# EAGLE design SparkFun_tDof-TMF8821_HQ (EAGLE 9.6.2)
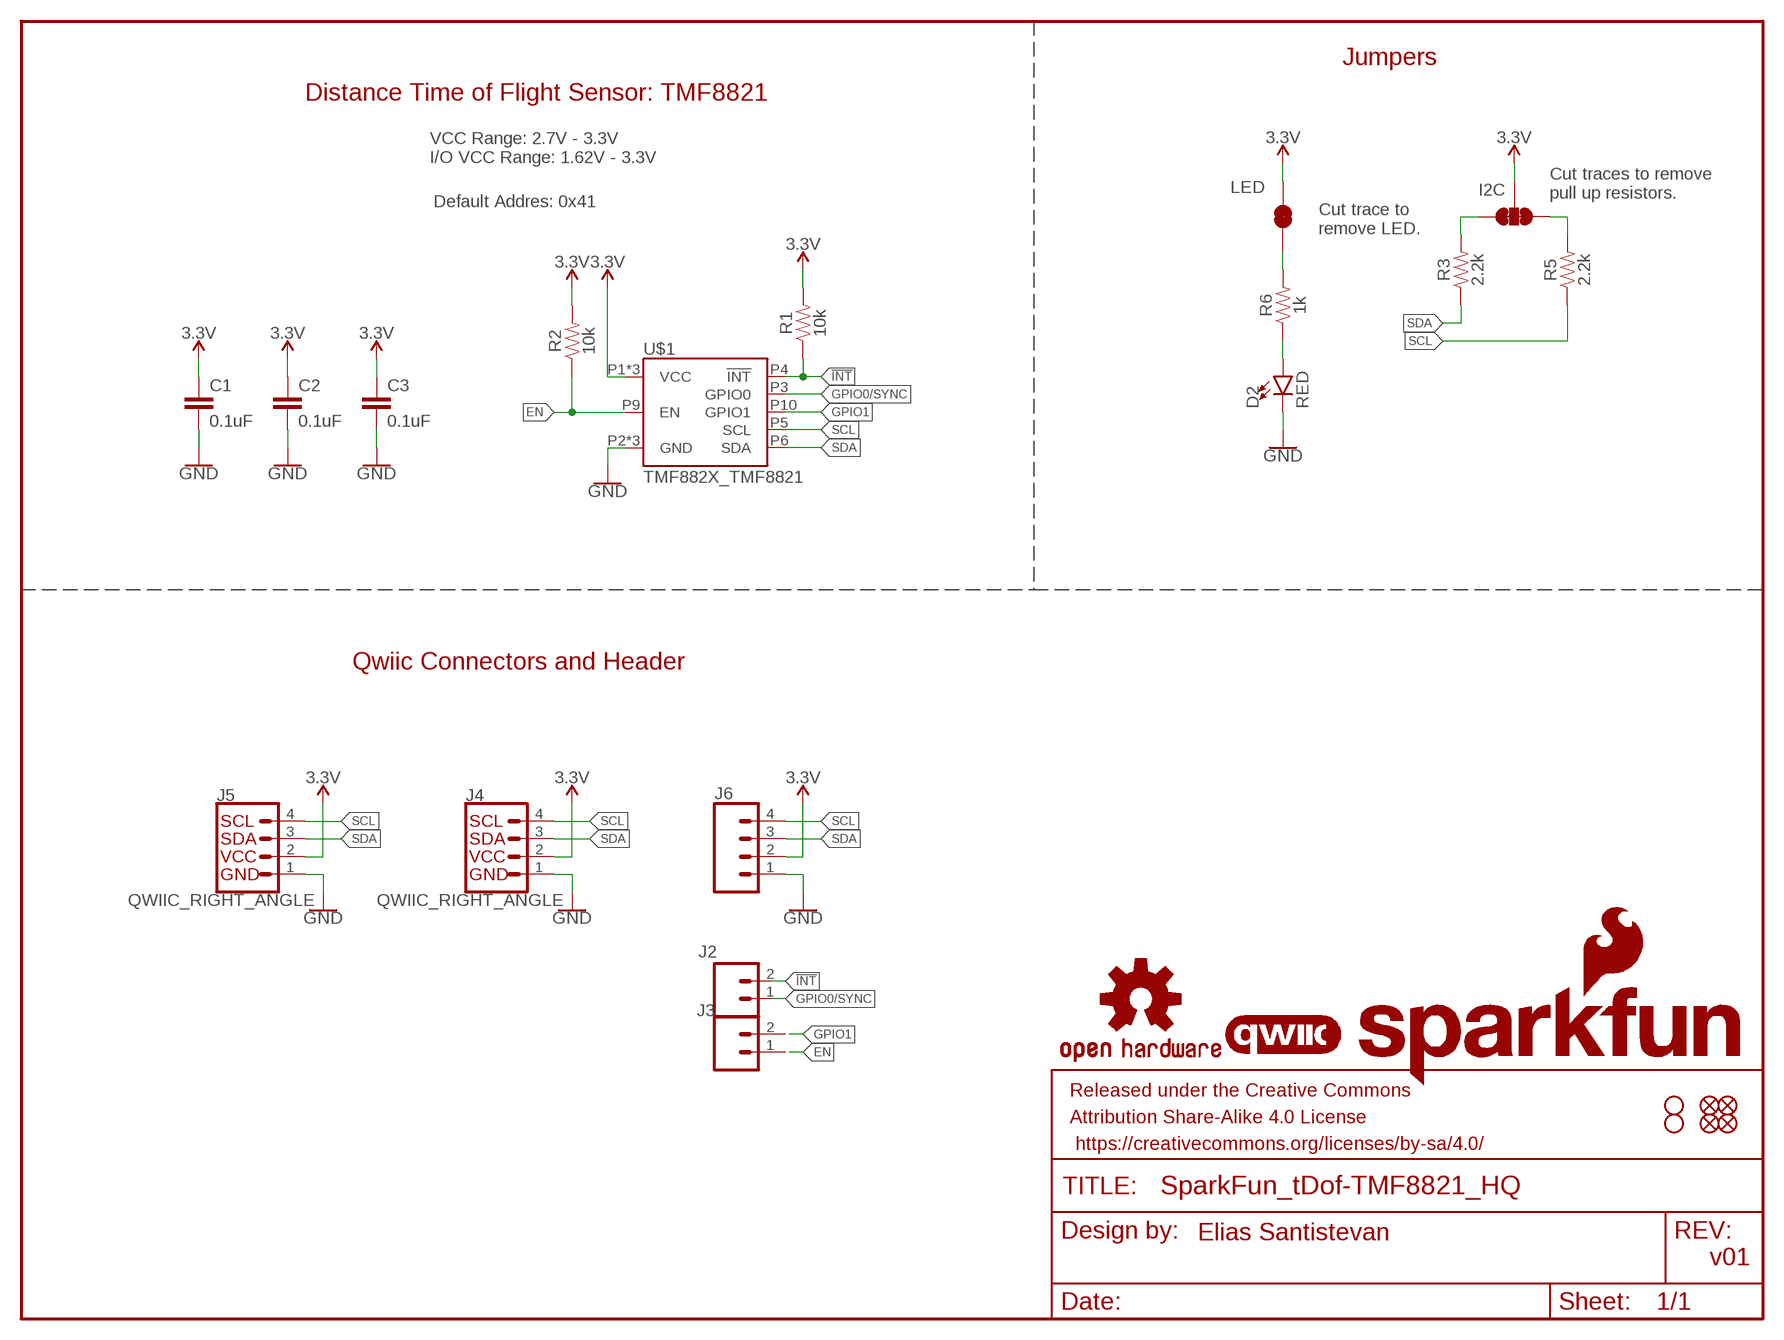
[diagram p0: schematic, sheet 1]

## Parts
C1  0.1uF  0.1UF-0402T-6.3V-10%-X7R  [0402-TIGHT]
C2  0.1uF  0.1UF-0402T-6.3V-10%-X7R  [0402-TIGHT]
C3  0.1uF  0.1UF-0402T-6.3V-10%-X7R  [0402-TIGHT]
D2  RED  LED-RED0603  [LED-0603]
FD5  FIDUCIALUFIDUCIAL  [FIDUCIAL-MICRO]
FD6  FIDUCIALUFIDUCIAL  [FIDUCIAL-MICRO]
FD7  FIDUCIALUFIDUCIAL  [FIDUCIAL-MICRO]
FD8  FIDUCIALUFIDUCIAL  [FIDUCIAL-MICRO]
FRAME2  FRAME-LETTER  [CREATIVE_COMMONS]
H7  STAND-OFFTIGHT  [STAND-OFF-TIGHT]
H8  STAND-OFFTIGHT  [STAND-OFF-TIGHT]
I2C  I2C_PU  JUMPER-SMT_3_2-NC_TRACE_SILK  [SMT-JUMPER_3_2-NC_TRACE_SILK]
J2  CONN_021X02_NO_SILK  [1X02_NO_SILK]
J3  CONN_021X02_NO_SILK  [1X02_NO_SILK]
J4  QWIIC_RIGHT_ANGLE  QWIIC_CONNECTORJS-1MM  [JST04_1MM_RA]
J5  QWIIC_RIGHT_ANGLE  QWIIC_CONNECTORJS-1MM  [JST04_1MM_RA]
J6  CONN_041X04_NO_SILK  [1X04_NO_SILK]
LED  LED  JUMPER-SMT_2_NC_TRACE_SILK  [SMT-JUMPER_2_NC_TRACE_SILK]
LOGO1  SFE_LOGO_NAME_FLAMEBLANK  [BLANK]
LOGO2  QWIIC_LOGO_3MM  [QWIIC_3MM]
LOGO3  OSHW-LOGONO_SILK  [DUMMY]
R1  10k  10KOHM-0402T-1/16W-1%  [0402-TIGHT]
R2  10k  10KOHM-0402T-1/16W-1%  [0402-TIGHT]
R3  2.2k  2.2KOHM-0402T-1/16W-1%  [0402-TIGHT]
R5  2.2k  2.2KOHM-0402T-1/16W-1%  [0402-TIGHT]
R6  1k  1KOHM-0402T-1/16W-1%  [0402-TIGHT]
U$1  TMF882X_TMF8821  [TMF882X]

## Nets
3.3V: C1.1 C2.1 C3.1 I2C.2 J4.2 J5.2 J6.2 LED.2 R1.2 R2.2 U$1.P1(VCC) U$1.P7(VCC) U$1.P12(VCC)
!INT!: J2.2 R1.1 U$1.P4(!INT!)
EN: J3.1 R2.1 U$1.P9(EN)
GND: C1.2 C2.2 C3.2 D2.C J4.1 J5.1 J6.1 U$1.P2(GND) U$1.P8(GND) U$1.P11(GND)
GPIO0/SYNC: J2.1 U$1.P3(GPIO0)
GPIO1: J3.2 U$1.P10(GPIO1)
N$5: D2.A R6.1
N$6: LED.1 R6.2
N$7: I2C.3 R3.2
N$8: I2C.1 R5.2
SCL: J4.4 J5.4 J6.4 R5.1 U$1.P5(SCL)
SDA: J4.3 J5.3 J6.3 R3.1 U$1.P6(SDA)

## Notes on the sheet
- Jumpers
- Distance Time of Flight Sensor: TMF8821
- VCC Range: 2.7V - 3.3V
  I/O VCC Range: 1.62V - 3.3V
- Cut traces to remove 
  pull up resistors.
- Default Addres: 0x41
- Cut trace to 
  remove LED.
- Qwiic Connectors and Header
- Elias Santistevan
- v01

## Library data of the parts
C1-C3 = SparkFun-Capacitors:0.1UF: 0.1µF ceramic capacitors A capacitor is a passive two-terminal electrical component used to store electrical energy temporarily in an electric field.; PROD_ID: CAP-14993
D2 = SparkFun-LED:LED-RED: Red SMD LED Used in manufacturing of most products at SparkFun Packages: 0603 - SMD 0603 package [Product Link] <http://docs.avagotech.com/docs/AV02-0551EN> 0603 SMART - SMD 0603 SMART package ( more efficient and expensive)[Product Link] <http://www.osram-os.com/Graphics/XPic2/00077099_0.pdf> 1206 - SMD1206 package [Product Link] <https://www.sparkfun.com/datasheets/DevTools/LilyPad/Q150OVS4.pdff> SparkFun Products: Pro Mini 328 -5V <https://www.sparkfun.com/products/821> RedBoard <https://www.sparkfun.com/products/12757> IOIO-OTG <https://www.sparkfun.com/products/13613>; PROD_ID: DIO-00819
FD5-FD8 = SparkFun-Aesthetics:FIDUCIAL: Fiducial Alignment Points Point-of-reference for pick-and-place machines and other optical instruments.
FRAME2 = SparkFun-Aesthetics:FRAME-LETTER: Schematic Frame - Letter Standard 8.5x11 US Letter frame
H7 H8 = SparkFun-Hardware:STAND-OFF: Stand Off Drill holes for mechanically mounting via screws, standoffs, etc. Note: Use the keepout ring to avoid running the screw head into surrounding components. Variant Overviews STAND-OFF - Mechanical footprint for a #4 phillips button head screw. STAND-OFF-TIGHT - Mechanical footprint for a #4 phillips button head screw, Example SparkFun Products Screw - Phillips Head (1/4", 4-40, 10 pack) <https://www.sparkfun.com/products/10453> (PRT-10453) Screw - Phillips Head (1/2", 4-40, 10 pack) <https://www.sparkfun.com/products/10452> (PRT-10452) Screw - Phillips Head (3/4", 4-40, 10 pack) <https://www.sparkfun.com/products/10451> (PRT-10451) Screw - Phillips Head (1", 4-40, 10 pack) <https://www.sparkfun.com/products/10450> (PRT-10450)
I2C = SparkFun-Jumpers:JUMPER-SMT_3_2-NC_TRACE: Normally closed trace jumper (2 of 2 connections) This jumper has a trace between all three pads so they are normally closed (NC). Use a razor knife to open the connection(s). For best results follow the IPC guidelines for cutting traces: Cutout at least 0.063 mm (0.005 in). Remove all loose material to clean up the cut area. Seal the cut with an approved epoxy. Reapply solder to reclose the connection(s).
J2 J3 = SparkFun-Connectors:CONN_02: Multi connection point. Often used as Generic Header-pin footprint for 0.1 inch spaced/style header connections On any of the 0.1 inch spaced packages, you can populate with these: Break Away Headers - Straight <https://www.sparkfun.com/products/116> (PRT-00116) Break Away Male Headers - Right Angle <https://www.sparkfun.com/products/553> (PRT-00553) Female Headers <https://www.sparkfun.com/products/115> (PRT-00115) Break Away Headers - Machine Pin <https://www.sparkfun.com/products/117> (PRT-00117) Break Away Female Headers - Swiss Machine Pin <https://www.sparkfun.com/products/743> (PRT-00743) For SCREWTERMINALS and SPRING TERMINALS visit here: Screw Terimnals on SparkFun.com <https://www.sparkfun.com/search/results?term=Screw+Terminals> (5mm/3.5mm/2.54mm spacing) This device is also useful as a general connection point to wire up your design to another part of your project. Our various solder wires solder well into these plated through hole pads. Hook-Up Wire - Assortment (Stranded, 22 AWG) <https://www.sparkfun.com/products/11375> (PRT-11375) Hook-Up Wire - Assortment (Solid Core, 22 AWG) <https://www.sparkfun.com/products/11367> (PRT-11367) View the entire wire category on our website here <https://www.sparkfun.com/categories/141> Special notes: Molex polarized connector foot print use with: PRT-08233 with associated crimp pins and housings. 2.54_SCREWTERM for use with PRT-10571. 3.5mm Screw Terminal footprints for PRT-08084 5mm Screw Terminal footprints for use with PRT-08432
J4 J5 = SparkFun-Connectors:QWIIC_CONNECTOR: SparkFun I2C Standard Qwiic Connector An SMD 1mm pitch JST connector makes it easy and quick (get it? Qwiic?) to connect I2C devices to each other. The Qwiic system <http://www.sparkfun.com/qwiic> enables fast and solderless connection between popular platforms and various sensors and actuators. We carry 200mm <https://www.sparkfun.com/products/14204>, 100mm <https://www.sparkfun.com/products/14205>, 50mm <https://www.sparkfun.com/products/14206>, and breadboard friendly <https://www.sparkfun.com/products/14207> Qwiic cables. We also offer 10 pcs strips <https://www.sparkfun.com/products/14323> the SMD connectors.; PROD_ID: CONN-13694
J6 = SparkFun-Connectors:CONN_04: Multi connection point. Often used as Generic Header-pin footprint for 0.1 inch spaced/style header connections On any of the 0.1 inch spaced packages, you can populate with these: Break Away Headers - Straight <https://www.sparkfun.com/products/116> (PRT-00116) Break Away Male Headers - Right Angle <https://www.sparkfun.com/products/553> (PRT-00553) Female Headers <https://www.sparkfun.com/products/115> (PRT-00115) Break Away Headers - Machine Pin <https://www.sparkfun.com/products/117> (PRT-00117) Break Away Female Headers - Swiss Machine Pin <https://www.sparkfun.com/products/743> (PRT-00743) For SCREWTERMINALS and SPRING TERMINALS visit here: Screw Terimnals on SparkFun.com <https://www.sparkfun.com/search/results?term=Screw+Terminals> (5mm/3.5mm/2.54mm spacing) This device is also useful as a general connection point to wire up your design to another part of your project. Our various solder wires solder well into these plated through hole pads. Hook-Up Wire - Assortment (Stranded, 22 AWG) <https://www.sparkfun.com/products/11375> (PRT-11375) Hook-Up Wire - Assortment (Solid Core, 22 AWG) <https://www.sparkfun.com/products/11367> (PRT-11367) View the entire wire category on our website here <https://www.sparkfun.com/categories/141> Special notes: Molex polarized connector foot print use with SKU : PRT-08231 with associated crimp pins and housings. 1MM SMD Version SKU: PRT-10208; PROD_ID: CONN-09696
LED = SparkFun-Jumpers:JUMPER-SMT_2_NC_TRACE: Normally closed trace jumper This jumper has a trace between two pads so it's normally closed (NC). Use a razor knife to open the connection. For best results follow the IPC guidelines for cutting traces: Cutout at least 0.063 mm (0.005 in). Remove all loose material to clean up the cut area. Seal the cut with an approved epoxy. Reapply solder to reclose the connection.
LOGO1 = SparkFun-Aesthetics:SFE_LOGO_NAME_FLAME: SparkFun Font Logo w/ Flame This is the SparkFun full logo. The logo on the schematic will always be the same size; the package variant is the height of the flame part of the logo. Default layer for the logo on the board is tSilk.
LOGO2 = SparkFun-Aesthetics:QWIIC_LOGO: Qwiic Logos for placement on schematic and PCB. The 5.5mm silk logo is best for placing next to Qwiic connector.
LOGO3 = SparkFun-Aesthetics:OSHW-LOGO: Open-Source Hardware (OSHW) Logo This logo indicates the piece of hardware it is found on incorporates a OSHW license and/or adheres to the definition of open source hardware found here: http://freedomdefined.org/OSHW
R1 R2 = SparkFun-Resistors:10KOHM: 10kΩ resistor A resistor is a passive two-terminal electrical component that implements electrical resistance as a circuit element. Resistors act to reduce current flow, and, at the same time, act to lower voltage levels within circuits. - Wikipedia; PROD_ID: RES-14241
R3 R5 = SparkFun-Resistors:2.2KOHM: 2.2kΩ resistor A resistor is a passive two-terminal electrical component that implements electrical resistance as a circuit element. Resistors act to reduce current flow, and, at the same time, act to lower voltage levels within circuits. - Wikipedia; PROD_ID: RES-14341
R6 = SparkFun-Resistors:1KOHM: 1kΩ resistor A resistor is a passive two-terminal electrical component that implements electrical resistance as a circuit element. Resistors act to reduce current flow, and, at the same time, act to lower voltage levels within circuits. - Wikipedia; PROD_ID: RES-14342
U$1 = TMF882X:TMF882X; PROD_ID: IC-16433

## Board
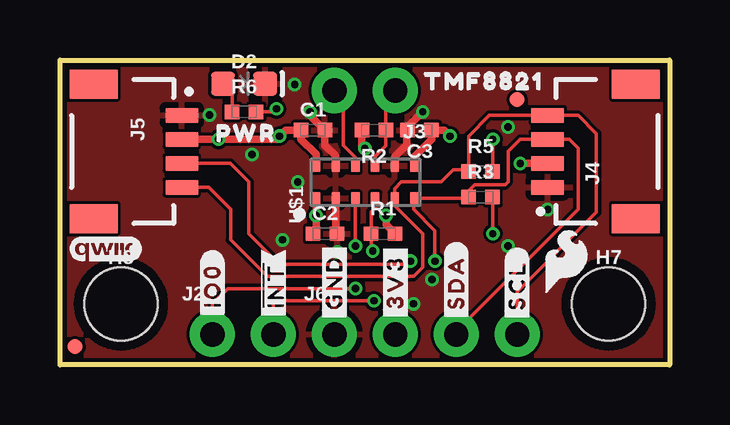
[diagram p1: board, top side]
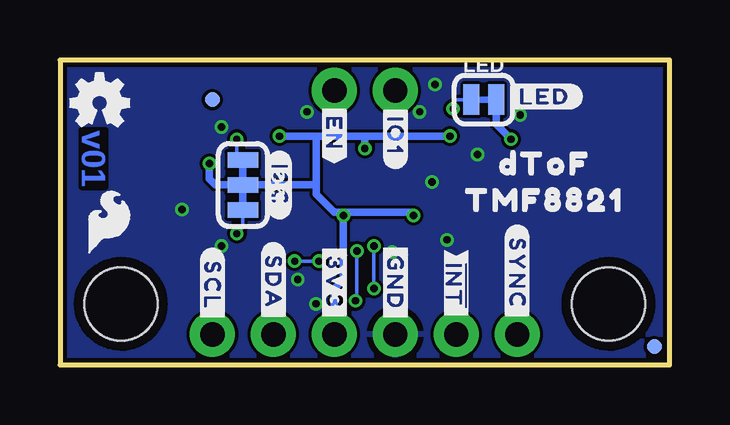
[diagram p2: board, bottom side, seen from below]

Size 25.4 x 12.7 mm. Coordinates in mm from the lower left corner, seen from the top.
Outline: 0,0 0,12.7 25.4,12.7 25.4,0 0,0
Copper layers (1*16): Top 0.035mm / dielectric 1.5mm / Bottom 0.035mm
Design rules "SparkFun-2-Layer-Minimum-JLCPCB": minimum track width 5mil, minimum drill 0.3mm, track to track 5mil, track to pad 5mil, pad to pad 5mil, via to via 5mil, smd to smd 5mil, copper to edge 7mil, drill to drill 7mil, minimum pad ring 5mil, minimum via ring 5mil, stop-mask expansion 2.5mil, vias tented up to drill 25mil, thermal gap 10mil

### Footprints (pad centres in the part's own frame; a part is rotated, then mirrored left to right if it is on the bottom)
0402-TIGHT = smd 0.6 x 0.6: 1 -0.5,0; 2 0.5,0
LED-0603 = smd 1 x 1: A -0.877,0; C 0.877,0
FIDUCIAL-MICRO = smd 0.635 x 0.635: 1 0,0
STAND-OFF-TIGHT = hole 3.048: 0,0
SMT-JUMPER_3_2-NC_TRACE_SILK = smd 0.66 x 1.27: 1 -1.041,0; 2 0,0; 3 1.041,0
1X02_NO_SILK = drill 1.016 pad 1.88: 1 0,0; 2 2.54,0
JST04_1MM_RA = smd 0.6 x 1.35: 1 -1.5,0; 2 -0.5,0; 3 0.5,0; 4 1.5,0 | smd 1.2 x 2: NC1 2.8,-3.675; NC2 -2.8,-3.675
1X04_NO_SILK = drill 1.016 pad 1.88: 1 0,0; 2 2.54,0; 3 5.08,0; 4 7.62,0
SMT-JUMPER_2_NC_TRACE_SILK = smd 0.66 x 1.27: 1 -0.521,0; 2 0.521,0
TMF882X = smd 0.5 x 0.35: P1 -0.686,2.032; P2 -0.686,1.212; P3 -0.686,0.392; P4 -0.686,-0.428; P5 -0.686,-1.248; P6 -0.686,-2.068; P7 0.664,-2.068; P8 0.664,-1.248; P9 0.664,-0.428; P10 0.664,0.392; P11 0.664,1.212; P12 0.664,2.032

### Placement (x,y rotation side)
C1  10.54,9.78 0 top
C2  11.05,5.46 0 top
C3  14.99,9.78 180 top
D2  7.67,11.71 0 top
FD5  19.05,11.05 0 bottom
FD6  0.64,0.76 0 bottom
FD7  0.64,0.76 0 top
FD8  19.05,11.05 0 top
FRAME2  -11.94,-12.95 0 top  (outside the outline)
H7  22.86,2.54 0 top
H8  2.54,2.54 0 top
I2C  17.78,7.49 270 bottom
J2  6.35,1.27 0 top
J3  13.97,11.43 180 top
J4  20.32,8.89 90 top
J5  5.08,8.89 270 top
J6  11.43,1.27 0 top
LED  7.75,11.05 0 bottom
LOGO1  -11.94,-12.95 0 top  (outside the outline)
LOGO2  1.91,4.83 0 top
LOGO3  -11.94,-12.95 0 top  (outside the outline)
R1  13.46,5.46 0 top
R2  13.08,9.78 180 top
R3  17.53,6.99 0 top
R5  17.53,8.05 0 top
R6  7.67,10.54 0 top
U$1  12.7,7.62 90 top
U$2  [#IO0#8]  6.35,3.3 90 top
U$3  [##INT##9]  8.89,3.3 90 top
U$4  [##INT##8]  8.89,3.3 270 bottom
U$5  [#SYNC#8]  6.35,3.81 270 bottom
U$6  [#IO1#8]  11.43,9.53 270 bottom
U$7  [DTOF882188211]  5.21,8.38 0 bottom
U$8  [TMF882188210]  5.21,6.86 0 bottom
U$9  [TMF882113]  17.65,11.81 0 top
U$10  [#3V3#0]  13.97,3.43 270 bottom
U$16  [#GND#4]  11.43,3.43 270 bottom
U$18  [#SDA#6]  16.51,3.43 270 bottom
U$19  [#SCL#5]  19.05,3.3 270 bottom
U$20  [#I2C#11]  16.26,7.49 270 bottom
U$22  [#LED#10]  5.21,11.18 0 bottom
U$31  [#EN#7]  13.97,9.65 270 bottom
U$33  [SFE_LOGO_FLAME_.1]  23.37,5.97 0 bottom
U$34  [OSHW-LOGO-MINI]  23.75,10.92 0 bottom
U$35  [SFE_LOGO_FLAME_.1]  21.08,4.32 0 top
U$37  [#3V3#0]  13.97,3.43 90 top
U$38  [#GND#4]  11.43,3.43 90 top
U$39  [#SCL#5]  19.05,3.3 90 top
U$40  [#SDA#6]  16.51,3.43 90 top
U$43  [PWR8821882023]  7.75,9.65 0 top

### Tracks (layer width: path | path; a pad name or v marks a point on that pad's centre or on a via)
3.3V  (via drill 0.3)
  Top 0.305: J5.2 v6.6,9.39 v6.6,9.4 9.02,9.4 v9.14,9.53 9.4,9.78 C1.1 10.04,9.39 10.67,8.76 U$1.P12 | C2.1 10.67,5.58 v10.67,6.22 U$1.P1 | J4.2 v19.18,8.39 v19.18,8.38 | v16.26,9.53 16,9.78 C3.1 15.49,9.39 14.77,8.67 U$1.P7 | R1.2 13.59,5.83 v13.59,6.22 | v12.7,9.02 12.58,9.14 R2.2
  Bottom 0.305: v6.6,9.4 7.23,10.02 LED.2 | 14.73,9.53 12.7,9.53 | 12.7,9.53 v9.14,9.53 | v10.67,6.22 10.79,6.35 13.59,6.35 | 13.59,6.35 13.97,6.35 14.73,7.11 14.73,7.49 | 14.73,7.49 14.73,9.53 | v19.18,8.38 19.18,7.75 18.92,7.49 I2C.2 14.73,7.49 | 14.73,9.53 v16.26,9.53 | J6.2 13.97,3.17 13.59,3.56 13.59,4.97 v13.59,6.22 13.59,6.35 | v12.7,9.02 12.7,9.53
!INT!  (via drill 0.3)
  Top 0.152: v13.03,4.74 12.96,4.8 R1.1 12.96,6.39 13.13,6.55 U$1.P4 | J2.2 8.89,2.54 9.02,2.67 v13.08,2.67
  Bottom 0.152: v13.03,4.74 13.03,2.72 v13.08,2.67
EN
  Top 0.152: U$1.P9 13.13,8.68 13.58,9.14 R2.1 13.58,11.04 J3.1
GND  (via drill 0.3)
  Top 0.305: U$1.P11 11.49,8.71 11.04,9.15 C1.2 10.41,10.41 v10.41,10.54 | 14.46,9.43 14.46,9.17 13.95,8.66 U$1.P8 | U$1.P2 11.49,5.46 C2.2 | C3.2 14.49,9.91 v15.11,10.54
  other vias: 8,8.76 15.49,3.56 11.56,4.7 20.32,6.48 6.22,10.41 9.78,11.68 18.67,9.91 18.67,4.95 14.73,2.54 9.27,5.21 9.91,7.62
  pour Top: 0,12.7 25.4,12.7 25.4,0 0,0
  pour Bottom: 0,12.7 25.4,12.7 25.4,0 0,0
GPIO0/SYNC  (via drill 0.3)
  Top 0.152: J2.1 6.35,2.54 6.99,3.17 v12.32,3.17 | U$1.P3 12.31,4.96 v12.32,4.95
  Bottom 0.152: v12.32,4.95 v12.32,3.17
GPIO1
  Top 0.152: U$1.P10 12.31,8.65 11.81,9.14 11.81,11.05 J3.2
N$5
  Top 0.152: R6.1 7.17,11.33 D2.A
N$6  (via drill 0.3)
  Top 0.152: R6.2 8.89,10.54 v9.02,10.67
  Bottom 0.152: v9.02,10.67 9.02,10.92 8.89,11.05 LED.1
N$7  (via drill 0.3)
  Top 0.152: R3.2 v18.03,5.47 v18.03,5.46
  Bottom 0.152: v18.03,5.46 17.78,5.71 I2C.3
N$8  (via drill 0.3)
  Top 0.152: R5.2 v18.03,9.39 v18.03,9.4
  Bottom 0.152: v18.03,9.4 18.03,8.79 I2C.1
SCL
  Top 0.152: J5.4 6.2,7.39 7.11,6.48 7.11,5.21 8.64,3.68 14.73,3.68 15.11,4.06 15.11,5.46 13.95,6.63 U$1.P5 13.95,7.34 14.22,7.62 15.88,7.62 16.38,8.13 16.95,8.13 R5.1 17.03,9.53 17.88,10.39 J4.4 21.59,10.39 22.35,9.63 22.35,6.35 19.05,3.05 J6.4
SDA  (via drill 0.3)
  Top 0.152: J5.3 7.1,8.39 7.87,7.62 7.87,5.46 9.14,4.19 14.48,4.19 v14.61,4.32 | J6.3 16.51,1.4 21.59,6.48 21.59,9.02 21.22,9.39 J4.3 19.17,9.39 18.67,8.89 18.67,7.62 18.54,7.49 17.27,7.49 17.03,7.25 R3.1 16.98,6.93 U$1.P6 14.73,6.9 14.73,6.48 15.62,5.59 v15.62,4.32
  Bottom 0.152: v15.62,4.32 v14.61,4.32

### Text on the board
Bottom: v01
Measures: Units in Inches
tDocu: Elias Santistevan